# EAGLE board Xibeca00 (EAGLE 9.6.2)
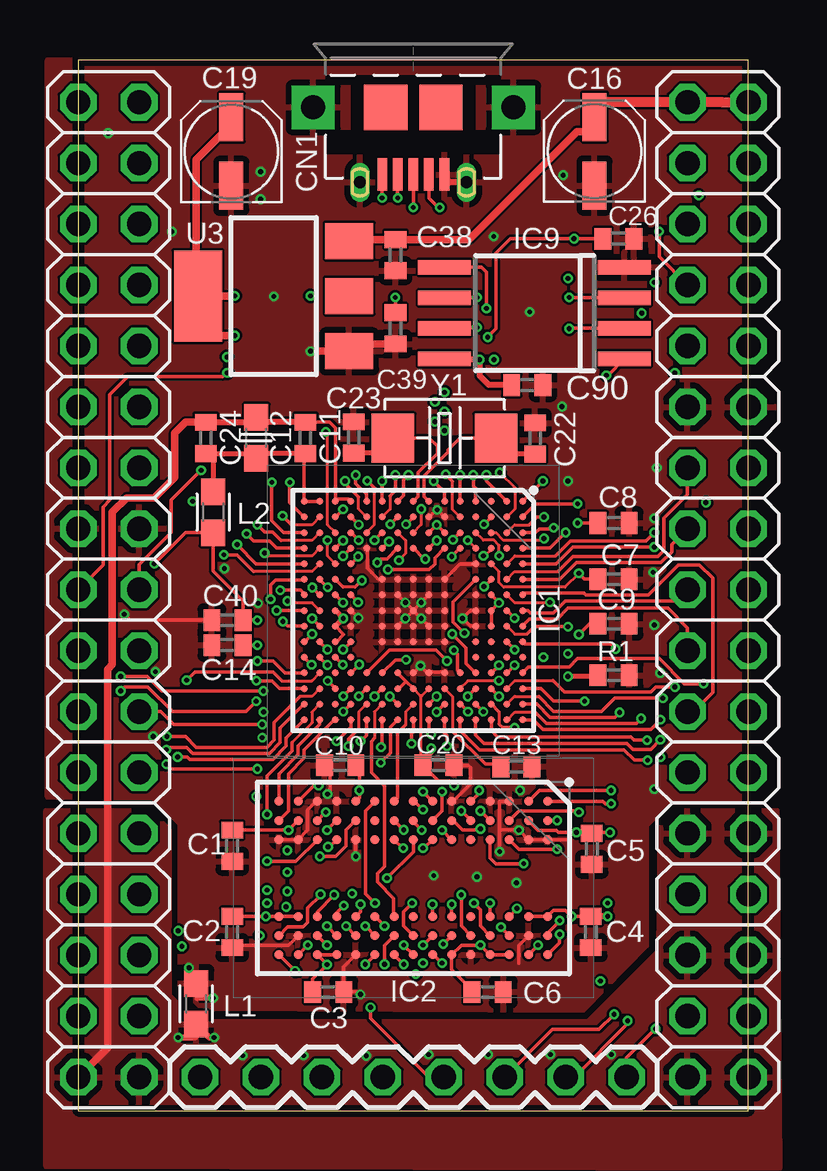
[diagram p2: board, top side]
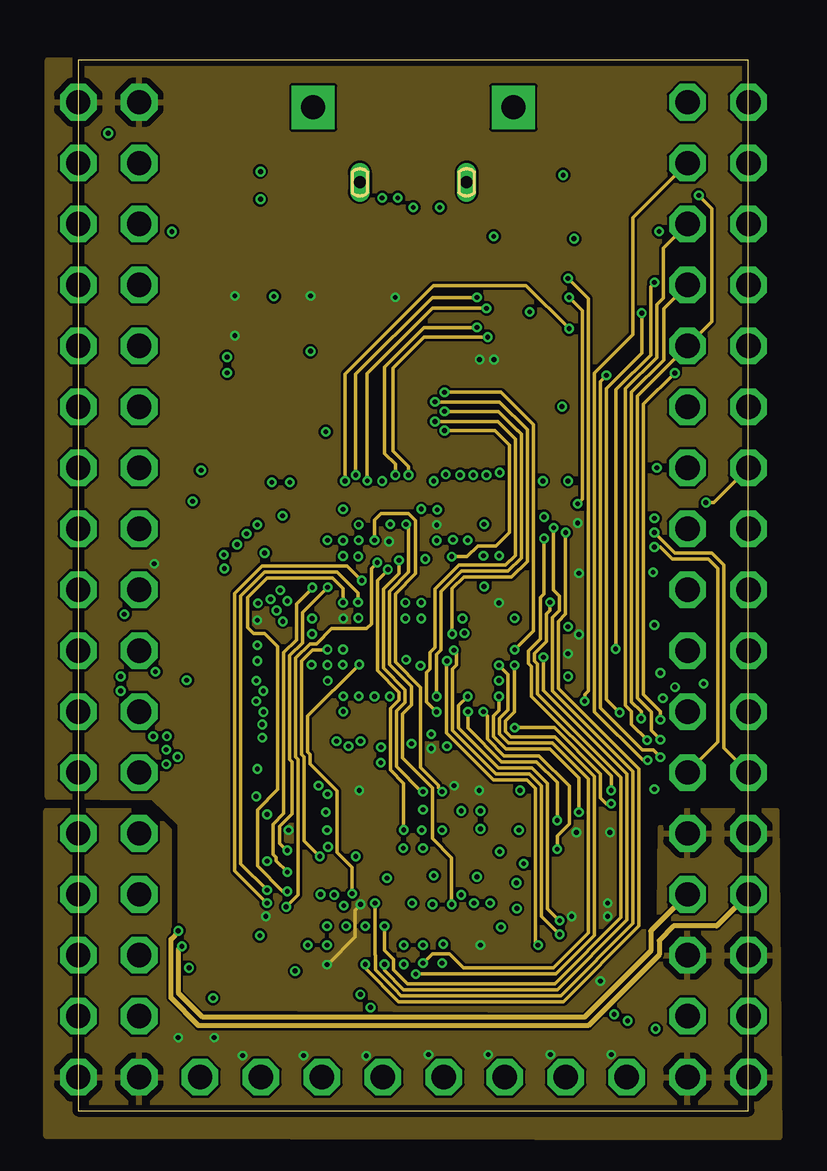
[diagram p3: board, inner layer InnerTop]
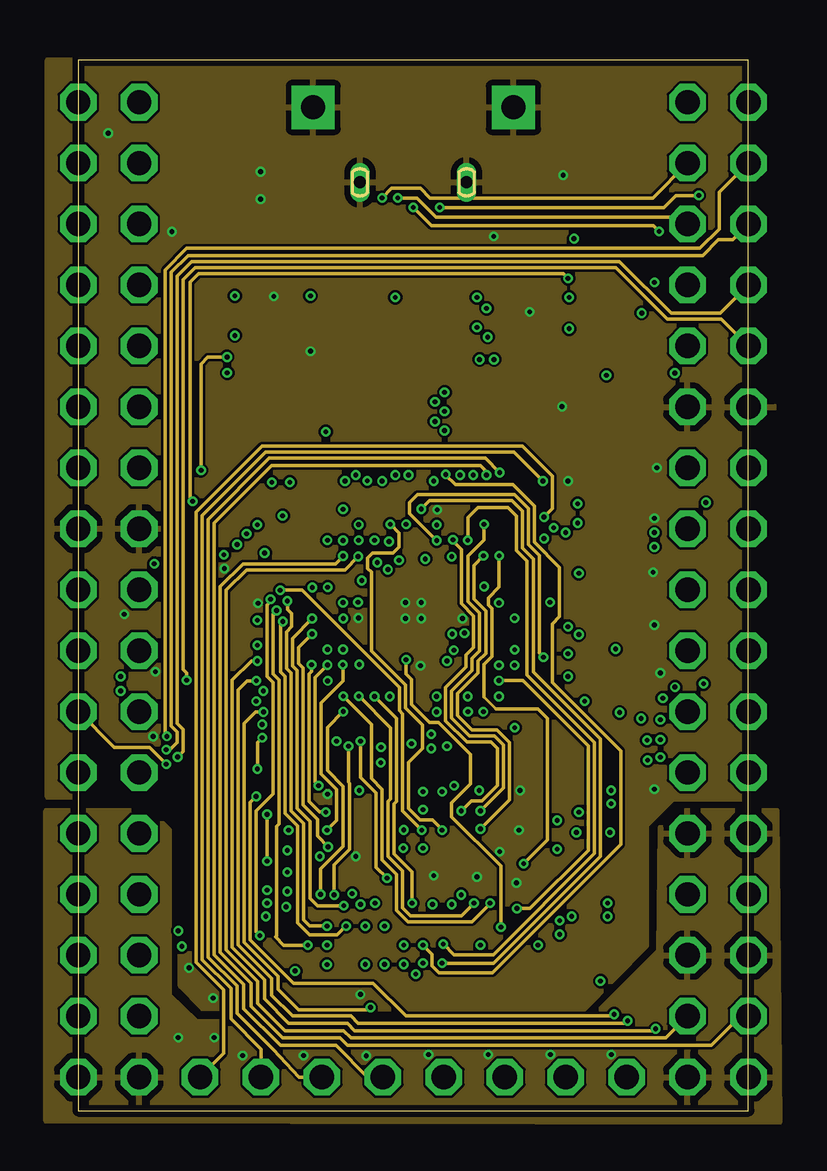
[diagram p4: board, inner layer InnerBottom]
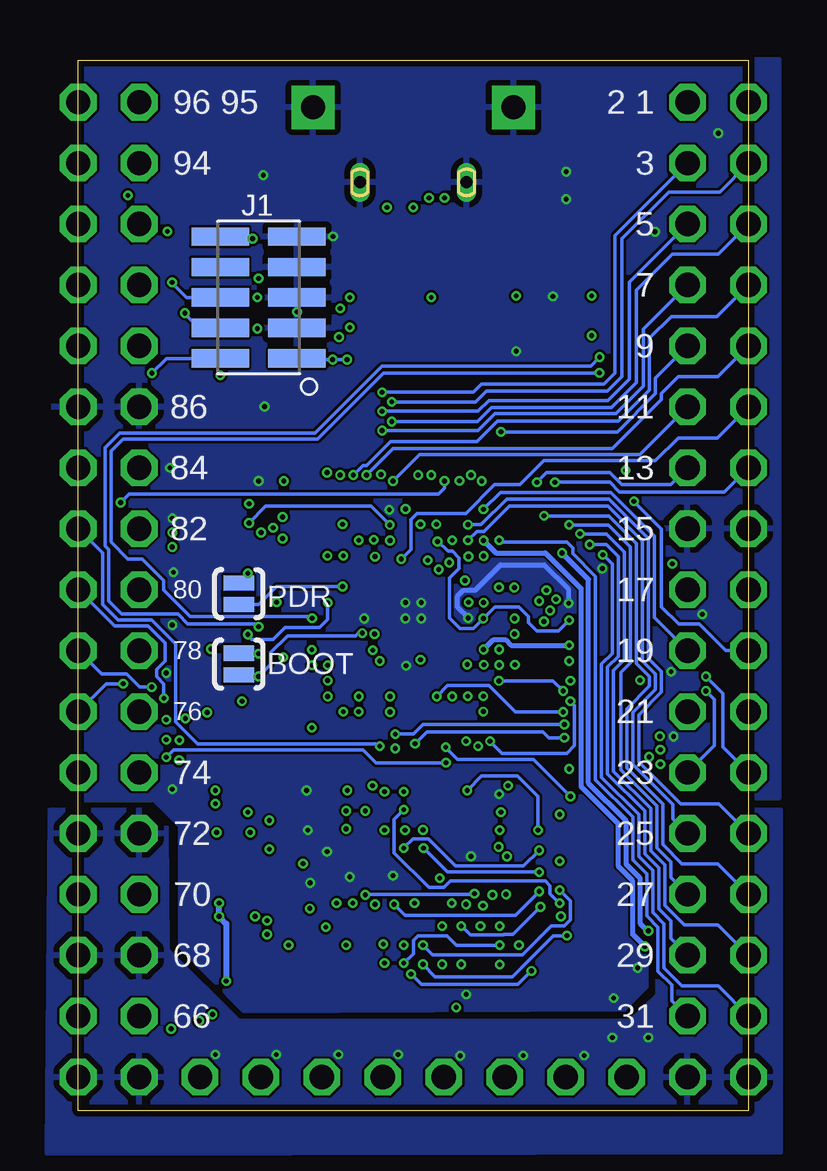
[diagram p5: board, bottom side, seen from below]

Size 27.94 x 43.8 mm. Coordinates in mm from the lower left corner, seen from the top.
Outline: 0,0 27.94,0 27.94,43.8 0,43.8 0,0
Copper layers (1*2*15*16): Top 0.035mm / dielectric 0.2mm / InnerTop 0.0175mm / dielectric 0.3mm / InnerBottom 0.0175mm / dielectric 0.2mm / Bottom 0.035mm
Design rules "PCBWay_4layer_20210129 *": minimum track width 0.1mm, minimum drill 0.2mm, track to track 0.1mm, track to pad 0.1mm, pad to pad 0.1mm, via to via 0.1mm, smd to smd 0mil, copper to edge 10mil, drill to drill 0.25mm, minimum pad ring 6mil, minimum via ring 4mil, stop-mask expansion 2mil, vias tented up to drill 25mil, thermal gap 10mil
Net classes: 1 power: width 0.178 mm, drill 0.305 mm, clearance 0.178 mm to class 0, clearance 0.178 mm

## Footprints (pad centres in the part's own frame; a part is rotated, then mirrored left to right if it is on the bottom)
SJ_2S-NO = smd 0.635 x 1.27: 1 -0.45,0; 2 0.45,0
C0402 = smd 0.7 x 0.9: 1 -0.65,0; 2 0.65,0
C0603 = smd 1.1 x 1: 1 -0.85,0; 2 0.85,0
UD-4X5,8_NICHICON = smd 2 x 1: + 1.425,0; - -1.425,0
HRS_ZX62RD-AB-5P8 = smd 0.4 x 1.35: 1 1.3,2.275; 2 0.65,2.275; 3 0,2.275; 4 -0.65,2.275; 5 -1.3,2.275 | smd 1.8 x 1.9: D_0 -1.15,-0.525; D_1 1.15,-0.525 | drill 1 pad 1.8 square: G -4.175,-0.525; G2 4.175,-0.525 | drill 0.5 long: G3 -2.225,2.6; G4 2.225,2.6
BGA201C65P15X15_1000X1000X60 = smd 0.3 x 0.3: A1 -4.55,4.55; A2 -3.9,4.55; A3 -3.25,4.55; A4 -2.6,4.55; A5 -1.95,4.55; A6 -1.3,4.55; A7 -0.65,4.55; A8 0,4.55; A9 0.65,4.55; A10 1.3,4.55; A11 1.95,4.55; A12 2.6,4.55; A13 3.25,4.55; A14 3.9,4.55; A15 4.55,4.55; B1 -4.55,3.9; B2 -3.9,3.9; B3 -3.25,3.9; B4 -2.6,3.9; B5 -1.95,3.9; B6 -1.3,3.9; B7 -0.65,3.9; B8 0,3.9; B9 0.65,3.9; B10 1.3,3.9; B11 1.95,3.9; B12 2.6,3.9; B13 3.25,3.9; B14 3.9,3.9; B15 4.55,3.9; C1 -4.55,3.25; C2 -3.9,3.25; C3 -3.25,3.25; C4 -2.6,3.25; C5 -1.95,3.25; C6 -1.3,3.25; C7 -0.65,3.25; C8 0,3.25; C9 0.65,3.25; C10 1.3,3.25; C11 1.95,3.25; C12 2.6,3.25; C13 3.25,3.25; C14 3.9,3.25; C15 4.55,3.25; D1 -4.55,2.6; D2 -3.9,2.6; D3 -3.25,2.6; D4 -2.6,2.6; D5 -1.95,2.6; D6 -1.3,2.6; D7 -0.65,2.6; D8 0,2.6; D9 0.65,2.6; D10 1.3,2.6; D11 1.95,2.6; D12 2.6,2.6; D13 3.25,2.6; D14 3.9,2.6; D15 4.55,2.6; E1 -4.55,1.95; E2 -3.9,1.95; E3 -3.25,1.95; E4 -2.6,1.95; E12 2.6,1.95; E13 3.25,1.95; E14 3.9,1.95; E15 4.55,1.95; F1 -4.55,1.3; F2 -3.9,1.3; F3 -3.25,1.3; F4 -2.6,1.3; F6 -1.3,1.3; F7 -0.65,1.3; F8 0,1.3; F9 0.65,1.3; F10 1.3,1.3; F12 2.6,1.3; F13 3.25,1.3; F14 3.9,1.3; F15 4.55,1.3; G1 -4.55,0.65; G2 -3.9,0.65; G3 -3.25,0.65; G4 -2.6,0.65; G6 -1.3,0.65; G7 -0.65,0.65; G8 0,0.65; G9 0.65,0.65; G10 1.3,0.65; G12 2.6,0.65; G13 3.25,0.65; G14 3.9,0.65; G15 4.55,0.65; H1 -4.55,0; H2 -3.9,0; H3 -3.25,0; H4 -2.6,0; H6 -1.3,0; H7 -0.65,0; H8 0,0; H9 0.65,0; H10 1.3,0; H12 2.6,0; H13 3.25,0; H14 3.9,0; H15 4.55,0; J1 -4.55,-0.65; J2 -3.9,-0.65; J3 -3.25,-0.65; J4 -2.6,-0.65; J6 -1.3,-0.65; J7 -0.65,-0.65; J8 0,-0.65; J9 0.65,-0.65; J10 1.3,-0.65; J12 2.6,-0.65; J13 3.25,-0.65; J14 3.9,-0.65; J15 4.55,-0.65; K1 -4.55,-1.3; K2 -3.9,-1.3; K3 -3.25,-1.3; K4 -2.6,-1.3; K6 -1.3,-1.3; K7 -0.65,-1.3; K8 0,-1.3; K9 0.65,-1.3; K10 1.3,-1.3; K12 2.6,-1.3; K13 3.25,-1.3; K14 3.9,-1.3; K15 4.55,-1.3; L1 -4.55,-1.95; L2 -3.9,-1.95; L3 -3.25,-1.95; L4 -2.6,-1.95; L12 2.6,-1.95; L13 3.25,-1.95; L14 3.9,-1.95; L15 4.55,-1.95; M1 -4.55,-2.6; M2 -3.9,-2.6; M3 -3.25,-2.6; M4 -2.6,-2.6; M5 -1.95,-2.6; M6 -1.3,-2.6; M7 -0.65,-2.6; M8 0,-2.6; M9 0.65,-2.6; M10 1.3,-2.6; M11 1.95,-2.6; M12 2.6,-2.6; M13 3.25,-2.6; M14 3.9,-2.6; M15 4.55,-2.6; N1 -4.55,-3.25; N2 -3.9,-3.25; N3 -3.25,-3.25; N4 -2.6,-3.25; N5 -1.95,-3.25; N6 -1.3,-3.25; N7 -0.65,-3.25; N8 0,-3.25; N9 0.65,-3.25; N10 1.3,-3.25; N11 1.95,-3.25; N12 2.6,-3.25; N13 3.25,-3.25; N14 3.9,-3.25; N15 4.55,-3.25; P1 -4.55,-3.9; P2 -3.9,-3.9; P3 -3.25,-3.9; P4 -2.6,-3.9; P5 -1.95,-3.9; P6 -1.3,-3.9; P7 -0.65,-3.9; P8 0,-3.9; P9 0.65,-3.9; P10 1.3,-3.9; P11 1.95,-3.9; P12 2.6,-3.9; P13 3.25,-3.9; P14 3.9,-3.9; P15 4.55,-3.9; R1 -4.55,-4.55; R2 -3.9,-4.55; R3 -3.25,-4.55; R4 -2.6,-4.55; R5 -1.95,-4.55; R6 -1.3,-4.55; R7 -0.65,-4.55; R8 0,-4.55; R9 0.65,-4.55; R10 1.3,-4.55; R11 1.95,-4.55; R12 2.6,-4.55; R13 3.25,-4.55; R14 3.9,-4.55; R15 4.55,-4.55
BGA90C80P9X15_800X1300X100 = smd 0.37 x 0.37: A1 -3.2,5.6; A2 -2.4,5.6; A3 -1.6,5.6; A7 1.6,5.6; A8 2.4,5.6; A9 3.2,5.6; B1 -3.2,4.8; B2 -2.4,4.8; B3 -1.6,4.8; B7 1.6,4.8; B8 2.4,4.8; B9 3.2,4.8; C1 -3.2,4; C2 -2.4,4; C3 -1.6,4; C7 1.6,4; C8 2.4,4; C9 3.2,4; D1 -3.2,3.2; D2 -2.4,3.2; D3 -1.6,3.2; D7 1.6,3.2; D8 2.4,3.2; D9 3.2,3.2; E1 -3.2,2.4; E2 -2.4,2.4; E3 -1.6,2.4; E7 1.6,2.4; E8 2.4,2.4; E9 3.2,2.4; F1 -3.2,1.6; F2 -2.4,1.6; F3 -1.6,1.6; F7 1.6,1.6; F8 2.4,1.6; F9 3.2,1.6; G1 -3.2,0.8; G2 -2.4,0.8; G3 -1.6,0.8; G7 1.6,0.8; G8 2.4,0.8; G9 3.2,0.8; H1 -3.2,0; H2 -2.4,0; H3 -1.6,0; H7 1.6,0; H8 2.4,0; H9 3.2,0; J1 -3.2,-0.8; J2 -2.4,-0.8; J3 -1.6,-0.8; J7 1.6,-0.8; J8 2.4,-0.8; J9 3.2,-0.8; K1 -3.2,-1.6; K2 -2.4,-1.6; K3 -1.6,-1.6; K7 1.6,-1.6; K8 2.4,-1.6; K9 3.2,-1.6; L1 -3.2,-2.4; L2 -2.4,-2.4; L3 -1.6,-2.4; L7 1.6,-2.4; L8 2.4,-2.4; L9 3.2,-2.4; M1 -3.2,-3.2; M2 -2.4,-3.2; M3 -1.6,-3.2; M7 1.6,-3.2; M8 2.4,-3.2; M9 3.2,-3.2; N1 -3.2,-4; N2 -2.4,-4; N3 -1.6,-4; N7 1.6,-4; N8 2.4,-4; N9 3.2,-4; P1 -3.2,-4.8; P2 -2.4,-4.8; P3 -1.6,-4.8; P7 1.6,-4.8; P8 2.4,-4.8; P9 3.2,-4.8; R1 -3.2,-5.6; R2 -2.4,-5.6; R3 -1.6,-5.6; R7 1.6,-5.6; R8 2.4,-5.6; R9 3.2,-5.6
SO8W = smd 0.6 x 2.2: 1 -1.905,-3.75; 2 -0.635,-3.75; 3 0.635,-3.75; 4 1.905,-3.75; 5 1.905,3.75; 6 0.635,3.75; 7 -0.635,3.75; 8 -1.905,3.75
2X5_1.27MM_SMD = smd 2.4 x 0.76: 1 -1.6,2.54; 2 1.6,2.54; 3 -1.6,1.27; 4 1.6,1.27; 5 -1.6,0; 6 1.6,0; 7 -1.6,-1.27; 8 1.6,-1.27; 9 -1.6,-2.54; 10 1.6,-2.54
1X08 = drill 1.016 octagon: 1 0,0; 2 2.54,0; 3 5.08,0; 4 7.62,0; 5 10.16,0; 6 12.7,0; 7 15.24,0; 8 17.78,0
2X17 = drill 1.016 octagon: 1 -20.32,-1.27; 2 -20.32,1.27; 3 -17.78,-1.27; 4 -17.78,1.27; 5 -15.24,-1.27; 6 -15.24,1.27; 7 -12.7,-1.27; 8 -12.7,1.27; 9 -10.16,-1.27; 10 -10.16,1.27; 11 -7.62,-1.27; 12 -7.62,1.27; 13 -5.08,-1.27; 14 -5.08,1.27; 15 -2.54,-1.27; 16 -2.54,1.27; 17 0,-1.27; 18 0,1.27; 19 2.54,-1.27; 20 2.54,1.27; 21 5.08,-1.27; 22 5.08,1.27; 23 7.62,-1.27; 24 7.62,1.27; 25 10.16,-1.27; 26 10.16,1.27; 27 12.7,-1.27; 28 12.7,1.27; 29 15.24,-1.27; 30 15.24,1.27; 31 17.78,-1.27; 32 17.78,1.27; 33 20.32,-1.27; 34 20.32,1.27
0603 = smd 1.1 x 1: 1 -0.85,0; 2 0.85,0
R0402 = smd 0.7 x 0.9: 1 -0.65,0; 2 0.65,0
SOT223 = smd 1.5 x 2: 1 -2.3,-3.15; 2 0,-3.15; 3 2.3,-3.15 | smd 3.8 x 2: 4 0,3.15
X2-SMD-5.0X3.2X1.3MM = smd 1.778 x 2.032: 1 -2.159,0; 2 2.159,0

## Placement (x,y rotation side)
BOOT  SOLDERJUMPERNO  [SJ_2S-NO]  21.24,18.62 270 bottom
BOOT1  SOLDERJUMPERNO  [SJ_2S-NO]  21.24,21.55 270 bottom
C1  100n  [C0402]  6.42,11.05 270 top
C2  100n  [C0402]  6.42,7.45 270 top
C3  100n  [C0402]  10.42,4.95 0 top
C4  100n  [C0402]  21.37,7.45 270 top
C5  100n  [C0402]  21.41,10.91 270 top
C6  100n  [C0402]  17.07,4.95 0 top
C7  100n  [C0402]  22.32,22.15 0 top
C8  100n  [C0402]  22.32,24.5 0 top
C9  100n  [C0402]  22.32,20.3 0 top
C10  100n  [C0402]  10.92,14.4 180 top
C11  100n  [C0402]  9.47,28.05 90 top
C12  1u  [C0603]  7.42,28.05 90 top
C13  2u2  [C0402]  18.27,14.35 0 top
C14  2u2  [C0402]  6.22,19.41 180 top
C16  10u  [UD-4X5,8_NICHICON]  21.52,39.99 90 top
C19  10u  [UD-4X5,8_NICHICON]  6.38,39.98 90 top
C20  100n  [C0402]  15.02,14.4 0 top
C22  22p  [C0402]  19.05,28.02 90 top
C23  22p  [C0402]  11.49,28.06 90 top
C24  100n  [C0402]  5.32,28.05 90 top
C26  100n  [C0402]  22.52,36.35 0 top
C38  100n  [C0402]  13.23,35.66 90 top
C39  100n  [C0402]  13.23,32.61 270 top
C40  100n  [C0402]  6.22,20.45 180 top
C90  100n  [C0402]  18.72,30.25 0 top
CN1  [HRS_ZX62RD-AB-5P8]  13.97,41.3 180 top
IC1  STM32H743IIK6  [BGA201C65P15X15_1000X1000X60]  13.97,20.85 270 top
IC2  AS4C16M32MSA-6BIN  [BGA90C80P9X15_800X1300X100]  13.97,9.7 270 top
IC9  S25FL064LABMFI010  [SO8W]  19.02,33.25 90 top
J1  FTS-105-01-F-DV  [2X5_1.27MM_SMD]  20.42,33.9 180 bottom
JP3  [1X08]  5.08,1.4 0 top
JP4  [2X17]  1.27,21.72 270 top
JP5  [2X17]  26.67,21.72 270 top
L1  Ferrite Bead  [0603]  4.92,4.45 90 top
L2  Ferrite Bead  [0603]  5.62,24.95 270 top
R1  10k  [R0402]  22.32,18.15 180 top
U3  TLV1117LV33DCYR  [SOT223]  8.14,33.96 90 top
Y1  8MHz  [X2-SMD-5.0X3.2X1.3MM]  15.27,28.04 0 top

## Tracks (layer width: path | path; a pad name or v marks a point on that pad's centre or on a via)
+3V3  (via drill 0.2)
  Top 0.13: IC1.G13 14.32,17.3 | 14.27,17.3 IC1.H13 | 14.29,14.48 14.29,17.3 | v20.87,22.4 20.3,21.83 17.73,21.83 17.55,22.01 17.55,22.47 IC1.C5
  Top 0.15: v11.77,8.6 11.77,8.3 IC2.L7 | IC2.M9 IC2.N9 v10.37,6.1 v10.37,6.09 9.77,5.49 C3.1 | IC2.B7 IC2.A7 19.82,8.35 20.32,8.35 v20.57,8.1 C4.1 | IC2.P7 IC2.R7 v7.82,8.1 C2.1 | IC2.P2 v8.77,11.7 C1.1 | IC2.L1 11.72,13.05 v11.72,13.35 11.72,14.25 C10.1 | v16.72,13.35 16.72,13.25 IC2.E1 | IC2.C9 IC2.D9 v16.77,6.9 15.97,6.9 IC2.F9 15.57,5.9 16.42,5.05 C6.1 | 14.32,17.3 14.29,17.3 14.27,17.3 | v12.96,23.73 IC1.K4 | IC1.N9 11.07,19.85 10.77,19.55 IC1.N10 | IC1.G3 v14.95,24.42 IC1.F3 | C39.1 v13.23,33.89 v13.22,33.9 | IC1.J12 13.67,17.9 | IC1.J13 13.37,17.6 13.67,17.9 | IC1.H13 13.67,17.9 | v7.47,20.45 C40.1 6.87,21.25 5.62,22.5 L2.2 4.47,24.1 v3.17,22.8 | C20.1 14.29,14.48 | C9.1 21.32,20.3 v20.87,19.85 | C8.1 v20.82,24.5 | v20.87,22.4 21.1,22.17 21.65,22.17 | v22.17,11.6 21.45,11.6 C5.1 21.38,11.6 v20.77,11.6 20.02,11.6 19.93,11.69 19.17,11.69 IC2.B2 | v14.72,15.1 14.72,14.9 14.37,14.55 C20.1 | C20.1 15.02,13.75 15.47,13.75 v15.67,13.55 | IC1.C9 IC1.C8 v17.54,21.17 IC1.C7
  Top 0.152: C7.1 21.65,22.17
  Top 0.2: IC1.N9 v11.05,20.52 IC1.N8
  Top 0.254: IC9.8 15.3,31.31 v16.73,31.31 16.73,30.64 17.12,30.25 C90.1 | v22.07,8.1 C4.1
  Top 0.305: C19.+ 6.38,41.1 4.92,39.65 4.92,34.03 U3.4 | v6.53,32.31 5.53,32.31 | v6.53,33.96 5.03,33.96 4.99,34
  Top 0.406: 4.99,34 U3.4 4.99,32.84 5.53,32.31
  InnerTop 0.15: v11.77,8.6 11.77,8.58 11.55,8.36 11.55,7.24 10.43,6.12 10.4,6.12 v10.37,6.09
  Bottom 0.15: J1.1 18.77,31.31 v16.73,31.31 | v7.47,20.45 7.92,20 8.82,20 9.17,20.35 9.17,20.6 9.57,21 10.57,21 v11.05,20.52 11.47,20.1 12.02,20.1 12.47,20.55 12.47,22.2 12.07,22.6 12.07,23.05 12.34,23.32 12.53,23.32 12.93,23.73 v12.96,23.73 | v20.42,19.05 20.44,19.07 BOOT.1 | v14.95,24.42 15.73,25.2 20.12,25.2 v20.82,24.5 | BOOT1.1 21.24,22.02 v20.87,22.4 | v11.72,13.35 11.12,13.95 9.62,13.95 8.77,13.1 v8.77,11.7 | v20.87,19.85 20.87,19.8 20.72,19.65 19.82,19.65 19.32,20.15 17.87,20.15 17.54,20.48 v17.54,21.17
  Bottom 0.254: v21.77,5.4 21.77,7.8 v22.07,8.1 v22.07,8.65
  other vias: 9.68,33.96 17.33,31.31
  pour InnerTop: -1.27,43.8 28.97,43.8 28.97,13 24.77,13 23.67,11.9 23.67,6.87 21.03,4.19 5.19,4.26 4.27,5.19 4.27,11.96 3.15,13.03 -1.27,13.07
+5V
  Top 0.305: 21.58,42.04 21.57,42.05 21.52,42 C16.+ 21.52,41.17 21.17,40.82 20.79,40.82 16.29,36.31 C38.2 11.35,36.31 11.23,36.19
  Top 0.406: U3.3 11.23,36.19 | JP5.2 26.82,42.04 JP5.1 21.58,42.04
+A3V3
  Top 0.15: C11.1 9.42,27.35 IC1.R1 IC1.P1
  Top 0.2: C24.1 5.62,27.1 L2.1
  Top 0.203: C11.1 7.62,27.4 C12.1 7.22,27.4 C24.1
ADC_I2C_SCL  (via drill 0.2)
  Top 0.15: IC1.R12 8.62,18.25 8.12,18.75 v7.47,18.75 | JP3.8 22.86,2.2 v24.07,3.41
  InnerBottom 0.15: v7.47,18.75 7.22,18.75 6.42,17.95 6.42,6.8 7.76,5.46 7.76,4.66 8.78,3.64 11.22,3.64 11.52,3.34 24,3.34 v24.07,3.41
ADC_I2C_SDA  (via drill 0.2)
  Top 0.15: IC1.R13 8.39,17.6 8.07,17.92 v7.42,17.92 | JP3.7 20.68,1.4 22.9,3.62 v22.9,3.74
  InnerBottom 0.15: v7.42,17.92 7.04,17.92 6.67,17.55 6.67,6.91 8.07,5.51 8.07,4.81 8.93,3.95 11.37,3.95 11.68,3.64 22.8,3.64 v22.9,3.74
ADC_IN3  (via drill 0.2)
  Top 0.13: IC1.P3 9.74,23.77 8.45,23.77
  Top 0.15: 8.45,23.77 8.1,24.12 7.77,24.12 v7.47,24.42
  Bottom 0.15: JP4.28 3.24,9.72 3.24,10.37 3.82,10.95 3.82,12.69 5.32,14.19 5.32,18.27 4.92,18.67 4.92,23.5 5.84,24.42 v7.47,24.42
ADC_IN4  (via drill 0.2)
  Top 0.13: IC1.N5 10.39,23.13 v10.39,23.78
  Bottom 0.15: JP4.32 3.19,4.59 3.19,5.24 3.77,5.82 3.77,7.65 4.24,8.12 4.24,9.87 4.82,10.45 4.82,12.24 6.37,13.79 6.37,22.26 7.32,23.21 7.32,23.45 7.57,23.7 10.31,23.7 v10.39,23.78
ADC_IN5  (via drill 0.2)
  Top 0.15: IC1.R4 8.27,23.45 7.97,23.74 7.32,23.74 v7.02,24.04
  Bottom 0.15: JP4.29 1.27,7.75 2.67,7.75 3.49,8.57 3.49,10.25 4.07,10.83 4.07,12.59 5.62,14.14 5.62,18.36 5.17,18.81 5.17,23.3 5.92,24.04 v7.02,24.04
ADC_IN8  (via drill 0.2)
  Top 0.13: IC1.P5 9.75,22.48 7.31,22.48
  Top 0.15: 7.31,22.48 6.62,23.17 v6.07,23.17
  Bottom 0.15: JP4.31 1.26,5.2 2.77,5.2 3.52,5.95 3.52,7.79 3.99,8.26 3.99,10.01 4.57,10.59 4.57,12.35 6.12,13.9 6.12,18.61 5.67,19.06 5.67,22.8 6.04,23.17 v6.07,23.17
ADC_IN9  (via drill 0.2)
  Top 0.15: IC1.R5 7.42,22.8 v6.62,23.6
  Bottom 0.15: JP4.30 3.24,7.18 3.24,7.92 3.74,8.42 3.74,10.11 4.32,10.69 4.32,12.49 5.87,14.04 5.87,18.49 5.42,18.94 5.42,23.09 5.92,23.6 v6.62,23.6
ADC_IN10  (via drill 0.2)
  Top 0.15: IC1.M2 v11.69,24.43
  Bottom 0.15: JP4.25 1.24,12.8 2.82,12.8 4.57,14.55 4.57,16.5 3.62,17.45 3.62,18.3 4.17,18.85 4.17,23.85 5.81,25.5 10.07,25.5 11.14,24.43 v11.69,24.43
ADC_IN11  (via drill 0.2)
  Top 0.15: IC1.M3 v11.69,23.78
  Bottom 0.15: JP4.26 3.14,12.16 3.14,12.76 4.82,14.44 4.82,16.6 3.87,17.55 3.87,18.2 4.42,18.75 4.42,23.75 5.87,25.2 9.97,25.2 11.02,24.15 11.32,24.15 v11.69,23.78
ADC_IN14  (via drill 0.2)
  Top 0.13: IC1.P2 9.74,24.42 8.9,24.42
  Top 0.15: 8.9,24.42 v8.52,24.8
  Bottom 0.15: JP4.27 1.28,10.3 2.78,10.3 3.57,11.09 3.57,12.8 5.07,14.3 5.07,16.75 4.12,17.7 4.12,18.09 4.67,18.64 4.67,23.65 5.82,24.8 v8.52,24.8
ADC_RST  (via drill 0.2)
  Top 0.15: IC1.K15 12.67,15.2 v12.62,15.15 | JP3.6 19.77,3.39 21.71,3.39 v22.34,4.02
  InnerBottom 0.15: v7.42,13.1 7.17,12.85 7.17,7.12 8.97,5.32 12.28,5.32 13.66,3.95 22.27,3.95 v22.34,4.02
  Bottom 0.15: v12.62,15.15 12.12,14.65 8.97,14.65 v7.42,13.1
ADC_SPI_MISO  (via drill 0.2)
  Top 0.15: IC1.M4 v11.04,23.12
  InnerBottom 0.15: v11.04,23.12 v11.04,23.11 10.73,22.8 6.87,22.8 5.92,21.85 5.92,6.6 7.2,5.31 7.2,4.35 8.53,3.03 10.91,3.03 11.22,2.73 26.4,2.73 27.61,3.94 JP5.32
ADC_SPI_MOSI  (via drill 0.2)
  Top 0.15: IC1.M5 v11.67,23.1
  InnerBottom 0.15: v11.67,23.1 11.12,22.55 7.02,22.55 6.17,21.7 6.17,6.7 7.48,5.39 7.48,4.48 8.63,3.34 11.06,3.34 11.37,3.03 17.72,3.03 18.08,3.03 24.49,3.03 JP5.31
AGND  (via drill 0.2)
  Top 0.15: IC1.M1 11.27,25.5 10.82,25.5 IC1.N1 10.72,28.45 10.47,28.7 C11.2 | 7.57,28.7 C12.2
  Top 0.254: v4.17,3.05 4.87,3.05 4.87,3.55 L1.1 5.48,3.05 v5.67,3.05 | C11.2 7.57,28.7 | C24.2 7.22,28.7 C12.2
  Top 0.305: C24.2 4.47,28.7 4.02,28.25 4.02,26.4 3.17,25.55 2.02,25.55 1.42,24.95 1.42,18.6 1.22,18.4 1.22,2.62 JP4.33
  other vias: 12.01,2.29 9.39,2.3 6.85,2.3 14.6,2.34 17.09,2.34 19.68,2.34 22.22,2.34
  pour InnerBottom: -1.33,12.5 2.97,12.5 3.77,11.7 3.77,4.81 4.92,3.7 21.26,3.7 24.23,6.66 24.28,11.79 24.98,12.5 29.11,12.5 29.22,-0.49 -1.33,-0.42
  pour Top: -1.33,12.5 2.97,12.5 3.77,11.7 3.77,4.8 4.91,3.7 21.26,3.7 24.23,6.66 24.28,11.79 24.98,12.5 29.11,12.5 29.24,-2.39 -1.33,-2.33
  pour InnerTop: -1.33,12.5 2.97,12.5 3.77,11.7 3.77,4.81 4.92,3.7 21.26,3.7 24.23,6.66 24.28,11.79 24.98,12.5 29.11,12.5 29.23,-1.12 -1.33,-1.06
  pour Bottom: -1.33,12.5 2.97,12.5 3.77,11.7 3.77,4.81 4.92,3.7 21.26,3.7 24.23,6.66 24.28,11.79 24.98,12.5 29.11,12.5 29.23,-1.76 -1.33,-1.69
BOOT  (via drill 0.2)
  Top 0.15: IC1.D6 15.62,21.2 15.62,20.38 v16.09,19.91 v16.1,19.91
  Top 0.2: R1.2 21.42,18.1 v20.42,18.1
  Bottom 0.15: v16.1,19.91 16.26,19.91 16.37,19.8 19.22,19.8 19.92,19.1 19.92,18.6 v20.42,18.1 21.18,18.1 BOOT.2
DAC1  (via drill 0.2)
  Top 0.15: IC1.N4 11.07,23.8 11.07,23.79 v11.04,23.77
  InnerTop 0.2: JP5.27 23.87,7.49 23.87,6.65 21.11,3.9 17.72,3.9 5.19,3.9 4.17,4.92 4.17,6.7 v4.32,6.85
  Bottom 0.2: v4.32,6.85 4.82,7.35 4.82,9.57 5.42,10.17 5.42,11.95 6.97,13.5 6.97,21.75 8.47,23.25 10.53,23.25 v11.04,23.77
DAC2  (via drill 0.2)
  Top 0.13: IC1.P4 9.75,23.13 7.89,23.13
  Top 0.15: 7.89,23.13 v7.77,23.25
  InnerTop 0.2: JP5.28 26.62,7.7 24.82,7.7 24.22,7.1 24.22,6.5 21.26,3.55 5.02,3.55 3.87,4.7 3.87,7.15 4.17,7.45 v4.17,7.5
  Bottom 0.2: v4.17,7.5 4.2,7.5 4.52,7.81 4.52,9.7 5.09,10.27 5.09,12.07 6.67,13.65 6.67,22.15 v7.77,23.25
EXTI0  (via drill 0.2)
  Top 0.13: IC1.N3 10.4,24.42 10.4,28.22
  Top 0.15: 10.4,28.22 v10.32,28.3
  Bottom 0.15: JP4.10 3.87,30.55 3.87,29.88 5.47,28.3 v10.32,28.3
EXTI2  (via drill 0.2)
  Top 0.15: IC1.D12 16.17,18.65 16.17,19.29 v15.59,19.87
  InnerTop 0.15: v15.59,19.87 15.59,21.76 16.07,22.25 18.07,22.25 18.72,22.9 18.72,28.4 17.57,29.55 v14.87,29.55
  Bottom 0.15: v14.87,29.55 11.37,29.55 10.92,30 5.87,30 5.27,30.6 5.27,36.35 3.32,38.3 1.2,38.3 JP4.3
EXTI3  (via drill 0.2)
  Top 0.15: IC1.R2 8.82,25.35 v8.82,26.2
  Bottom 0.15: JP4.14 3.24,26.1 5.27,26.1 5.77,26.6 8.42,26.6 v8.82,26.2
EXTI4  (via drill 0.2)
  Top 0.15: IC1.H4 14.42,23 v14.47,23
  Bottom 0.15: JP4.11 1.29,28.05 2.93,28.05 3.88,27.1 8.52,27.1 9.52,26.1 10.58,26.1 11.78,24.9 13.81,24.9 14.07,24.64 14.07,23.4 v14.47,23
EXTI7  (via drill 0.2)
  Top 0.15: IC1.R3 8.57,24.1 8.07,24.6 v8.07,26.2
  Bottom 0.15: v8.07,26.2 5.77,26.2 5.37,25.8 1,25.8 JP4.13
EXTI8  (via drill 0.2)
  Top 0.15: IC1.G14 v14.94,17.27
  InnerTop 0.15: v14.94,17.27 14.94,19.02 15.12,19.2 15.12,21.65 15.97,22.5 17.92,22.5 18.47,23.04 18.47,28.2 18.32,28.35 17.52,29.15 v15.28,29.15 v15.27,29.15
  Bottom 0.15: v15.27,29.15 11.27,29.15 10.82,29.6 5.87,29.6 4.97,30.5 4.97,34.53 JP4.6
EXTI9  (via drill 0.2)
  Top 0.15: IC1.F14 v14.94,16.62
  InnerTop 0.15: v14.94,16.62 14.52,17.04 14.52,18.26 14.67,18.41 14.67,19.1 14.87,19.3 14.87,21.75 15.87,22.75 17.82,22.75 18.22,23.15 18.22,28 17.49,28.72 v14.87,28.72
  Bottom 0.15: JP4.5 1.26,35.7 3.17,35.7 4.67,34.2 4.67,30.35 5.72,29.3 10.72,29.3 11.29,28.72 v14.87,28.72
EXTI10  (via drill 0.2)
  Top 0.15: IC1.B10 v18.2,19.22
  InnerTop 0.15: v18.2,19.22 18.97,19.99 18.97,28.6 17.62,29.95 v15.27,29.95
  Bottom 0.15: v15.27,29.95 11.47,29.95 11.12,30.3 6.02,30.3 5.57,30.75 5.57,36.47 JP4.4
EXTI11  (via drill 0.2)
  Top 0.15: IC1.E4 v15.57,23.09
  InnerTop 0.15: v15.57,23.09 16.22,23.09 16.67,23.55 17.42,23.55 17.97,24.1 17.97,27.75 17.37,28.35 v15.27,28.35
  Bottom 0.15: JP4.8 4.37,32.59 4.37,30.2 5.52,29.05 10.57,29.05 11.27,28.35 v15.27,28.35
EXTI13  (via drill 0.2)
  Top 0.15: v16.47,26.5 16.47,26.05 16.57,25.95 IC1.D1
  Bottom 0.15: JP4.7 1.32,33.1 3.22,33.1 4.12,32.2 4.12,30.05 5.42,28.75 10.47,28.75 11.32,27.9 14.92,27.9 15.92,26.9 16.07,26.9 v16.47,26.5
EXTI14  (via drill 0.2)
  Top 0.15: v15.92,26.5 IC1.E1
  Bottom 0.15: JP4.9 1.28,30.6 2.92,30.6 3.62,29.9 3.62,29.65 5.67,27.6 14.82,27.6 v15.92,26.5
EXTI15  (via drill 0.2)
  Top 0.15: v14.82,26.25 15.27,25.8 IC1.F1
  Bottom 0.15: JP4.12 4.53,27.35 13.72,27.35 v14.82,26.25
FLASH_CLK  (via drill 0.2)
  Top 0.15: IC9.6 16.6,33.88 v16.62,33.9 | v11.57,26.5 11.57,26.15 12.02,25.7 IC1.L1
  InnerTop 0.15: v11.57,26.5 11.57,30.7 14.77,33.9 v16.62,33.9
FLASH_DQ0  (via drill 0.2)
  Top 0.13: IC1.L3 12.35,24.43 12.35,25.95
  Top 0.15: IC9.5 16.81,35.15 17.02,34.95 v17.02,33.45 | 12.35,25.95 v12.05,26.25
  InnerTop 0.15: v12.05,26.25 12.05,30.72 14.77,33.45 v17.02,33.45
FLASH_DQ1  (via drill 0.2)
  Top 0.13: IC1.L2 11.69,25.08 11.69,25.58
  Top 0.15: IC9.2 20.48,32.61 v20.47,32.6 | 11.69,25.58 11.12,26.15 v11.12,26.25
  InnerTop 0.15: v11.12,26.25 11.12,30.7 14.82,34.4 18.67,34.4 v20.47,32.6
FLASH_DQ2  (via drill 0.2)
  Top 0.15: IC9.3 20.48,33.88 v20.47,33.9 | v20.82,25.3 19.07,25.3 IC1.A2
  InnerTop 0.15: v20.47,33.9 21.02,33.35 21.02,25.5 v20.82,25.3
FLASH_DQ3  (via drill 0.2)
  Top 0.13: IC1.K2 13,25.08 13,25.62
  Top 0.15: IC9.7 15.31,32.65 v16.62,32.65 | v13.22,26.5 13.22,25.85 13,25.62
  InnerTop 0.15: v13.22,26.5 13.22,26.95 12.77,27.4 12.77,31 14.42,32.65 v16.62,32.65
FLASH_NCS  (via drill 0.2)
  Top 0.15: IC9.1 22.08,30.65 v22.02,30.65 | IC1.J15 13.02,16 13.02,14.91 v12.61,14.51
  InnerTop 0.15: v22.02,30.65 21.77,30.4 21.77,16.8 23.53,15.04 23.97,15.04 v24.27,14.74
  Bottom 0.15: v24.27,14.74 23.96,15.05 16.07,15.05 15.52,14.5 v12.62,14.5 v12.61,14.51
GND  (via drill 0.2)
  Top 0.15: IC2.P8 8.77,6.9 6.52,6.9 C2.2 | IC1.F2 v14.97,25.05 14.92,25.05 IC1.G2 | IC1.J7 v13.64,21.18 IC1.H8 | IC1.H8 v14.29,20.52 v14.3,20.52 IC1.G9 | IC1.G7 v14.3,21.18 IC1.H8 | IC1.J9 v13.64,20.52 IC1.H8 | IC2.B8 18.37,6.9 18.37,6.15 | IC2.N1 9.92,12.9 9.57,12.55 9.57,11.7 IC2.P3 IC2.R3 | IC1.L4 12.07,23.4 12.07,22.6 12.52,22.15 IC1.K6 | C10.2 10.27,14.25 10.49,14.02 10.49,13.3 v10.39,13.2 | IC2.L3 v11.57,10.6 | IC2.L9 11.07,6 C3.2 11.66,4.95 v11.76,4.84 | 20.38,11.3 IC2.A3 IC2.B3 v18.37,11.7 17.56,11.7 | IC1.D9 16.35,20.2 v16.03,20.52 v16.02,20.52 16.35,20.85 IC1.D8 | IC1.H12 v14.27,18.55 14.57,18.25 IC1.G12 14.67,18.3 15.22,18.3 IC1.F12 | 17.56,11.7 17.56,12.9 IC2.C1 | 17.56,11.7 v17.56,10.81 v17.57,10.8 | IC1.D5 15.92,22.8 IC1.F6 | v1.92,20.7 2.17,20.45 C40.2 | C20.2 16.25,14.4 16.35,14.3 16.35,13.62 15.62,12.9 IC2.F1 | IC1.M8 v11.68,20.54
  Top 0.254: v4.62,5.95 4.62,5.61 L1.2 4.97,5.35 4.97,4.7 v5.62,4.7 | CN1.G3 15.49,38.7 15.42,38.77 CN1.5
  Top 0.305: C39.2 11.58,31.96 11.37,31.75 11.37,31.73 U3.1 v9.68,31.66
  Bottom 0.2: v7.49,21.15 7.49,21.72 8.52,22.75 10.33,22.75 11.38,21.7 11.87,21.7 12.12,21.45 12.12,20.98 v11.68,20.54
  other vias: 8.15,33.94 7.6,39.14 7.6,37.99 18.42,13.35 17.32,36.45 24.27,18.25 24.02,20.25 23.97,22.45 24.02,24.7 6.09,22.6 3.22,18.3 20.42,26.25 14.82,9.8 18.27,9.5 24.02,13.4 24.12,26.8 20.17,29.35 18.82,33.3 20.22,39 1.25,40.74 3.9,36.64 3.12,15.6 16.62,9.75
  pour Top: -1.27,43.8 28.97,43.8 28.97,13 24.77,13 23.67,11.9 23.67,6.87 21.03,4.19 5.18,4.26 4.27,5.19 4.27,11.96 3.15,13.03 -1.27,13.07
  pour Bottom: -1.27,43.8 28.97,43.8 28.97,13 24.77,13 23.67,11.9 23.67,6.88 21.03,4.19 5.19,4.26 4.27,5.19 4.27,11.96 3.15,13.03 -1.27,13.07
  pour InnerBottom: -1.27,43.8 28.97,43.8 28.97,13 24.77,13 23.67,11.9 23.67,6.88 21.03,4.19 5.19,4.26 4.27,5.19 4.27,11.96 3.15,13.03 -1.27,13.07
I2C_SCL  (via drill 0.2)
  Top 0.15: IC1.A5 19.92,22.8 20.62,23.5 v24.02,23.5
  InnerTop 0.15: v24.02,23.5 24.27,23.5 24.77,23 26.27,23 26.67,22.6 26.67,15.37 JP5.23
I2C_SDA  (via drill 0.2)
  Top 0.13: IC1.B5 18.2,23.13 19.9,23.13
  Top 0.15: 19.9,23.13 20.52,23.75 23.67,23.75 v24.02,24.1
  InnerTop 0.15: JP5.24 26.92,15.12 26.92,22.75 26.42,23.25 24.87,23.25 v24.02,24.1
LPTIM1_CH1  (via drill 0.2)
  Top 0.15: IC1.B8 v18.19,20.53 | JP4.17 1.04,22.75 1.04,25.16 1.32,25.45 1.32,29.85 2.07,30.6 6.02,30.6 6.18,30.76 v6.21,30.76
  Bottom 0.15: v18.19,20.53 18.26,20.6 23.27,20.6 24.37,21.7 24.37,22.1 25.27,23 25.87,23 26.57,23.7 26.57,27.5 26.07,28 17.97,28 15.22,30.75 6.25,30.75 6.24,30.76 v6.21,30.76
LPTIM1_CH2  (via drill 0.2)
  Top 0.13: IC1.B9 18.2,19.87 18.71,19.87
  Top 0.15: v20.42,20.17 19.02,20.17 18.71,19.87 | JP4.18 2.54,22.77 3.87,24.1 3.87,25.45 v5.12,26.7
  InnerBottom 0.15: v6.2,31.41 5.4,31.41 5.12,31.13 v5.12,26.7
  Bottom 0.15: v20.42,20.17 20.54,20.3 23.37,20.3 23.77,20.7 26.12,20.7 26.67,21.25 26.67,23.4 26.82,23.55 26.82,27.65 26.22,28.25 18.07,28.25 15.27,31.05 6.57,31.05 v6.2,31.41
N$1  (via drill 0.2)
  Top 0.15: C14.1 6.88,19.4 v7.47,19.4 | IC1.M10 v11.05,19.23 v11.04,19.23
  Bottom 0.2: v7.47,19.4 9.89,19.4 10.13,19.64 10.63,19.64 v11.04,19.23
N$11
  Top 0.13: IC1.F13 15.6,17.27 15.6,15.82
  Top 0.152: 15.6,15.82 16.97,14.45 17.52,14.45 C13.1
N$12
  Top 0.15: 13.32,28.04 14.63,28.04 14.97,27.7 14.97,27.4 14.17,26.6 14.17,25.6 IC1.H1
  Top 0.2: Y1.1 13.32,28.04 13.47,28.04 12.84,27.41 C23.1
N$15
  Top 0.15: Y1.2 15.91,28.04 15.42,27.55 15.42,27.45 14.42,26.45 14.42,25.6 IC1.G1
  Top 0.2: Y1.2 17.27,28.04 17.94,27.37 C22.1
NRST  (via drill 0.2)
  Top 0.15: v13.77,26.5 13.57,26.3 13.57,25.65 IC1.J1 | C26.1 v20.67,36.35 18.02,36.35 17.42,35.75 17.42,32.6 v17.07,32.25
  InnerTop 0.15: v13.77,26.5 13.77,26.85 13.12,27.5 13.12,30.95 14.42,32.25 v17.07,32.25
  Bottom 0.2: J1.10 21.93,36.35 v20.67,36.35
PDR_ON  (via drill 0.2)
  Top 0.152: IC1.C6 v16.92,21.85
  Bottom 0.15: BOOT1.2 20.42,21.1 19.67,21.85 v16.92,21.85
RAM_!CAS  (via drill 0.2)
  Top 0.13: v19.67,21.2 19.64,21.17 18.2,21.17 IC1.B7
  Top 0.15: IC2.K7 v12.77,7.7
  InnerTop 0.15: v19.67,21.2 19.67,20.85 19.52,20.7 19.52,19.56 19.02,19.05 19.02,18.74 19.14,18.61 19.14,17.37 22.62,13.9 22.62,8.05 19.87,5.3 13.72,5.3 13.15,5.87 13.15,6.3 12.77,6.68 v12.77,7.7
RAM_!CS  (via drill 0.2)
  Top 0.15: IC2.J8 12.77,6.9 v12.77,6.1 | v14.94,23.76 IC1.G4
  InnerTop 0.15: v19.39,18.9 19.39,17.52 22.87,14.04 22.87,7.95 19.97,5.05 13.57,5.05 12.77,5.85 v12.77,6.1
  InnerBottom 0.15: v14.94,23.76 13.82,24.89 13.82,25.35 14.15,25.67 18.19,25.67 18.77,25.09 18.77,23.59 19.22,23.14 19.22,19.07 v19.39,18.9
RAM_!RAS  (via drill 0.2)
  Top 0.15: IC2.J9 v13.57,6.1 | IC1.R6 9.39,22.12 8.22,22.12 8.02,21.92 v8.02,21.32
  InnerBottom 0.15: v7.57,7.3 7.42,7.45 7.42,12.5 8.12,13.2 8.12,17.85 7.87,18.1 7.87,21.07 8.02,21.22 v8.02,21.32
  Bottom 0.15: v13.57,6.1 13.06,5.59 9.83,5.59 8.12,7.3 v7.57,7.3 | v7.57,7.3
RAM_!WE  (via drill 0.2)
  Top 0.15: IC2.K8 v11.97,7.7 | IC1.J4 12.87,23 12.62,23 v12.47,22.85
  InnerTop 0.15: v8.67,8.5 9.17,9 9.17,14.64 9.07,14.74 9.07,18.86 9.66,19.46 9.93,19.46 10.57,20.1 12.02,20.1 12.22,20.3 12.22,22.6 v12.47,22.85
  Bottom 0.15: v11.97,7.7 11.59,7.32 10.21,7.32 10.19,7.35 9.82,7.35 v8.67,8.5
RAM_A0  (via drill 0.2)
  Top 0.13: IC1.E2 15.6,25.07 15.6,26.23
  Top 0.15: IC2.G8 v14.37,6.9 | 15.6,26.23 15.54,26.29 15.54,26.3 v15.32,26.52
  InnerBottom 0.15: v14.37,6.9 14.75,6.52 14.75,6.04 15.04,5.75 17.27,5.75 22.62,11.09 22.62,15 19.77,17.85 19.77,20.3 20.07,20.6 20.07,22.65 19.02,23.7 19.02,25.2 18.12,26.1 15.72,26.1 15.32,26.5 v15.32,26.52
RAM_A1  (via drill 0.2)
  Top 0.13: v14.3,25.08 14.3,24.42 IC1.H3
  Top 0.15: v15.17,6.15 14.82,6.5 IC2.G9
  InnerBottom 0.15: v15.17,6.15 17.32,6.15 21.77,10.6 21.77,15.5 18.97,18.3 18.97,23 18.52,23.45 18.52,24.99 18.09,25.42 14.64,25.42 v14.3,25.08
RAM_A2  (via drill 0.2)
  Top 0.15: IC2.F7 v15.57,8.6 | IC1.H2 v13.67,24.45
  InnerTop 0.15: v15.57,8.6 15.57,10.55 14.77,11.35 14.77,13.45 13.52,14.7 13.52,16.54 13.89,16.91 13.89,17.68 12.97,18.6 12.97,21.64 13.77,22.44 13.77,24.35 v13.67,24.45
RAM_A3  (via drill 0.2)
  Top 0.15: IC2.F3 v15.17,11.7 | IC1.J2 v13.01,24.45
  InnerBottom 0.15: v15.17,11.7 15.17,11.73 14.78,12.12 14.25,12.12 13.77,12.6 13.77,14.52 14.34,15.1 14.34,16.08 13.64,16.78 13.64,17.75 12.22,19.17 12.22,22.45 12.07,22.6 12.07,23.05 12.27,23.25 13.12,23.25 13.37,23.5 13.37,24.09 v13.01,24.45
RAM_A4  (via drill 0.2)
  Top 0.13: IC1.J3 13.65,23.77 13.65,23.23 v13.37,22.95
  Top 0.15: IC2.G1 v14.37,13.3
  InnerTop 0.15: v14.37,13.3 14.32,13.3 13.27,14.35 13.27,16.65 13.63,17.01 13.63,17.54 12.72,18.45 12.72,21.75 13.37,22.4 v13.37,22.95
RAM_A5  (via drill 0.2)
  Top 0.15: IC1.K3 v12.35,23.78 | IC2.G2 15.17,12.5 v15.17,13.3
  InnerTop 0.15: v15.17,13.3 15.02,13.45 15.02,13.55 14.27,14.3 14.27,15.45 14.27,15.46 14.27,17.65 13.22,18.7 13.22,21.54 14.07,22.39 14.07,24.6 13.77,24.9 12.62,24.9 12.35,24.63 v12.35,23.78
RAM_A6  (via drill 0.2)
  Top 0.15: v10.4,21.82 IC1.P6 | IC2.G3 14.42,10.95 v14.37,10.95
  InnerTop 0.15: v10.4,21.82 9.34,20.76 9.34,19.49 8.82,18.97 8.82,14.64 8.92,14.54 8.92,12.38 8.39,11.85 8.39,11.14 8.69,10.85 v8.72,10.85
  Bottom 0.15: v8.72,10.85 9.37,10.2 12.22,10.2 13.35,11.32 13.99,11.32 v14.37,10.95
RAM_A7  (via drill 0.2)
  Top 0.13: 11.55,21.83 11.04,21.83
  Top 0.15: v11.82,22.1 11.55,21.83 | IC1.N6 11.04,21.83 | v14.37,12.55 14.02,12.9 IC2.H1
  InnerTop 0.15: v11.82,22.1 v11.81,22.1 11.21,22.7 7.66,22.7 6.52,21.55 6.52,10 v7.87,8.65
  Bottom 0.15: v14.37,12.55 14.77,12.15 14.77,10.75 13.32,9.3 12.68,9.3 12.41,9.57 8.46,9.57 8.27,9.38 8.27,9.05 v7.87,8.65
RAM_A8  (via drill 0.2)
  Top 0.15: v14.32,11.7 13.97,12.05 IC2.H2
  Top 0.152: IC1.R7 9.42,21.55 9.27,21.7 v8.42,21.7
  InnerBottom 0.15: v8.42,21.7 9.34,21.7 13.39,17.64 13.39,16.68 13.52,16.55 13.52,12.5 v14.32,11.7
RAM_A9  (via drill 0.2)
  Top 0.15: IC1.P7 v9.76,21.81 | IC2.J3 13.52,10.95 v13.55,10.95
  InnerTop 0.15: v9.76,21.81 9.76,21.79 9.09,21.13 9.09,19.62 8.57,19.1 8.57,12.38 8.12,11.93 8.12,10.68 8.25,10.55 8.25,10.42 v8.72,9.95
  Bottom 0.15: v8.72,9.95 12.55,9.95 v13.55,10.95
RAM_A10  (via drill 0.2)
  Top 0.15: IC1.N7 v11.04,21.18 | v14.77,8.6 IC2.G7
  InnerTop 0.15: v11.04,21.18 11.04,21.77 10.61,22.2 7.87,22.2 7.07,21.39 7.07,20.15 7.32,19.9 7.77,19.9 8.32,19.35 8.32,13.4 7.47,12.55 7.47,10.2 8.52,9.14 v8.72,9.14
  Bottom 0.15: v14.77,8.6 14.32,8.15 9.72,8.15 v8.72,9.14
RAM_A11  (via drill 0.2)
  Top 0.15: IC2.H9 v13.57,6.9 | v11.66,21.19 IC1.M7
  InnerTop 0.15: v11.66,21.19 11.66,21.58 10.8,22.45 7.77,22.45 6.77,21.45 6.77,10.3 v7.87,9.2
  Bottom 0.15: v7.87,9.2 7.42,8.75 7.42,7.95 7.67,7.7 8.22,7.7 9.42,6.5 13.17,6.5 v13.57,6.9
RAM_A12  (via drill 0.2)
  Top 0.15: IC2.H3 13.97,10.8 v12.87,9.7 | IC1.L15 12.02,15.65 v11.77,15.4
  InnerBottom 0.15: v12.87,9.7 12.42,10.15 12.42,13.25 11.77,13.9 v11.77,15.4
RAM_BA0
  Top 0.13: IC1.K14 12.35,16.63 12.35,15.53
  Top 0.15: 12.35,15.53 12.22,15.4 12.22,14.1 12.77,13.55 12.77,10.19 12.47,9.89 12.47,9.53 13.15,8.85 13.15,8.12 IC2.J7
RAM_BA1  (via drill 0.2)
  Top 0.15: IC2.H8 13.57,7.7 13.57,8.3 v13.92,8.65
  Top 0.152: v12.35,17.27 12.35,17.29 IC1.K13
  InnerBottom 0.15: v13.92,8.65 13.92,9.95 13.17,10.7 13.17,12.8 13.27,12.9 13.27,16.35 v12.35,17.27
RAM_CLK
  Top 0.13: IC1.H14 13.65,16.63 13.65,16.08
  Top 0.15: 13.65,16.08 13.32,15.75 13.32,13.05 IC2.J1
RAM_CLKE  (via drill 0.2)
  Top 0.15: IC2.J2 v13.57,11.7 | IC1.F4 14.87,23.05 14.87,22.8 14.63,22.56 v12.91,22.56
  InnerTop 0.15: v13.57,11.7 13.57,13.65 13.02,14.2 13.02,16.76 13.38,17.12 13.38,17.44 12.47,18.35 12.47,22.1 v12.92,22.55 v12.91,22.56
RAM_D0  (via drill 0.2)
  Top 0.15: IC1.M14 v11.06,16.64 v11.05,16.64 | v10.1,9.01 10.1,8.98 9.57,8.45 9.57,7.85 9.38,7.66 8.73,7.66 IC2.R8
  InnerBottom 0.15: v11.05,16.64 10.39,15.98 10.39,14.17 11.05,13.52 11.05,11.02 10.1,10.08 v10.1,9.01
RAM_D1  (via drill 0.2)
  Top 0.13: IC1.L14 11.69,16.62 11.69,15.92
  Top 0.15: 11.69,15.92 11.27,15.5 v11.27,15.2 | IC2.N7 9.97,8.3 v10.67,9
  InnerBottom 0.15: v10.67,9 10.67,10.25 11.32,10.9 11.32,13.65 11.27,13.7 v11.27,15.2
RAM_D2  (via drill 0.2)
  Top 0.15: IC2.R9 v9.04,5.82 | IC1.B12 v18.19,18.57
  InnerTop 0.15: v18.19,18.57 18.19,16.62 17.81,16.24 17.81,15.81 18.03,15.59 19.87,15.59 21.52,13.94 21.52,7.3 19.91,5.7 v14.07,5.7
  Bottom 0.15: v9.04,5.82 9.61,5.26 13.63,5.26 v14.07,5.7
RAM_D3  (via drill 0.2)
  Top 0.15: IC2.N8 v10.37,6.9 | IC1.C12 v17.54,18.57
  InnerTop 0.15: v17.54,18.57 17.92,18.19 17.92,16.7 17.56,16.34 17.56,15.7 17.93,15.34 19.77,15.34 21.27,13.84 21.27,7.4 19.81,5.95 16.07,5.95 15.47,6.55 14.77,6.55 v14.37,6.15
  Bottom 0.15: v10.37,6.9 12.17,6.9 12.57,7.3 13.77,7.3 13.97,7.1 13.97,6.55 v14.37,6.15
RAM_D4  (via drill 0.2)
  Top 0.15: IC2.P9 v9.57,6.9 | IC1.R8 v8.27,20.85
  InnerBottom 0.15: v9.57,6.9 8.57,6.9 8.22,7.25 8.27,7.3 8.27,11.84 8.37,11.94 8.37,17.95 8.12,18.2 8.12,20.7 v8.27,20.85
RAM_D5  (via drill 0.2)
  Top 0.13: IC1.P8 9.75,21.17 8.8,21.17
  Top 0.15: 8.8,21.17 v8.72,21.25 | IC2.M8 v10.37,7.7
  InnerBottom 0.15: v10.37,7.7 9.65,7.7 9.4,7.95 9.4,11.97 8.87,12.5 8.87,18.25 8.68,18.44 8.68,19.96 8.9,20.18 8.9,20.71 8.72,20.9 v8.72,21.25
RAM_D6  (via drill 0.2)
  Top 0.15: IC1.P9 v9.75,20.52 | IC2.M7 10.77,8.25 v11.07,8.55
  InnerBottom 0.15: v11.07,8.55 9.97,8.55 9.67,8.85 9.67,12.05 9.12,12.6 9.12,18.35 8.93,18.54 8.93,19.69 v9.75,20.52
RAM_D7  (via drill 0.2)
  Top 0.15: IC2.L8 v11.17,7.7 | IC1.R9 8.72,20.2 v8.53,20.39
  InnerBottom 0.15: v8.53,20.39 8.43,20.29 8.43,18.29 8.62,18.1 8.62,12.4 9.15,11.87 9.15,7.82 9.65,7.32 10.79,7.32 v11.17,7.7
RAM_D8  (via drill 0.2)
  Top 0.15: IC2.L2 11.17,11.7 11.17,11.05 10.72,10.6 v10.07,10.6 | IC1.P10 v10.39,19.23
  InnerTop 0.15: v10.39,19.23 10.36,19.2 9.77,19.2 9.32,18.75 9.32,14.85 9.42,14.75 9.42,11.25 v10.07,10.6
RAM_D9  (via drill 0.2)
  Top 0.15: IC2.M3 10.47,11 v10.42,11 | IC1.R10 v9.75,19.87
  InnerBottom 0.15: v9.75,19.87 9.19,19.31 9.19,18.63 9.37,18.45 9.37,12.75 9.97,12.15 9.97,11.44 v10.42,11
RAM_D10  (via drill 0.2)
  Top 0.15: IC2.M2 v10.37,11.7
  Top 0.152: v11.03,18.59 IC1.N11
  InnerBottom 0.15: v10.37,11.7 IC2.M2 10.77,13.4 10.12,14.05 10.12,17 11.03,17.91 v11.03,18.59
RAM_D11  (via drill 0.2)
  Top 0.15: v10.02,13.55 9.82,13.55 IC2.P1 | v10.39,18.58 IC1.P11
  InnerBottom 0.15: v10.02,13.55 9.87,13.7 9.87,18.06 v10.39,18.58
RAM_D12  (via drill 0.2)
  Top 0.15: IC2.N2 v10.32,12.45 | IC1.R11 v9.73,18.59
  InnerBottom 0.15: v9.73,18.59 9.73,18.31 9.62,18.2 9.62,12.9 10.07,12.45 v10.32,12.45
RAM_D13
  Top 0.15: IC1.P15 10.07,16.1 9.17,15.2 9.17,14.85 8.37,14.05 IC2.R1
RAM_D14  (via drill 0.2)
  Top 0.13: IC1.P14 9.74,16.62 9.74,16.17 8.92,15.35
  Top 0.15: IC2.N3 9.07,10.4 v7.87,10.4 | 8.92,15.35 8.92,15 7.87,13.95 v7.87,12.35
  InnerBottom 0.15: v7.87,12.35 v7.87,10.4
RAM_D15
  Top 0.15: IC2.R2 8.77,12.5 8.77,14.05 9.42,14.7 9.42,15.05 10.67,16.3 IC1.N15
RAM_D16  (via drill 0.2)
  Top 0.15: IC1.M12 v11.72,18.6 | IC2.E8 15.97,7.7 v15.97,9
  InnerTop 0.15: v11.42,9.05 11.42,10.15 10.79,10.77 10.79,13.33 9.67,14.45 9.67,14.85 9.57,14.95 9.57,16.45 v11.72,18.6
  Bottom 0.15: v11.42,9.05 11.44,9.02 15.94,9.02 v15.97,9
RAM_D17  (via drill 0.2)
  Top 0.15: IC2.D7 v17.17,8.65
  Top 0.152: IC1.M13 v11.05,17.28
  InnerBottom 0.15: v11.05,17.28 12.22,16.11 12.22,13.85 12.67,13.4 12.67,10.45 13.27,9.85 13.27,8.34 13.74,7.87 16.42,7.87 17.17,8.62 v17.17,8.65
RAM_D18  (via drill 0.2)
  Top 0.15: IC2.D8 16.77,7.7 16.77,8.37 v16.5,8.65
  Top 0.152: IC1.L13 v11.7,17.28
  InnerBottom 0.15: v11.7,17.28 13.02,15.96 13.02,13 12.92,12.9 12.92,10.59 13.52,9.99 13.52,8.45 13.85,8.12 15.98,8.12 v16.5,8.64 v16.5,8.65
RAM_D19  (via drill 0.2)
  Top 0.15: v15.37,18.75 14.92,19.2 12.97,19.2 IC1.L12 | IC2.B9 v19.17,6.9
  InnerTop 0.15: v19.17,6.9 19.07,7 19.07,13.44 18.71,13.8 17.31,13.8 15.36,15.75 v15.36,18.74 v15.37,18.75
RAM_D20  (via drill 0.2)
  Top 0.15: IC2.C8 v17.62,7.65 | IC1.K12 13.22,18.8 v13.67,18.8
  InnerBottom 0.15: v17.62,7.65 17.62,10.2 15.57,12.25 15.57,12.83 16.35,13.61 16.35,14.85 15.03,16.17 14.64,16.17 13.89,16.93 13.89,17.98 13.67,18.2 v13.67,18.8
RAM_D21  (via drill 0.2)
  Top 0.15: v15.66,19.2 15.82,19.04 15.82,18.35 IC1.E12 | v20.07,7.35 20.07,7 IC2.A9
  InnerTop 0.15: v20.07,7.35 19.32,8.1 19.32,13.54 18.82,14.05 17.42,14.05 15.61,15.85 15.61,18.42 15.78,18.59 15.77,18.6 15.77,19.09 v15.66,19.2
RAM_D22  (via drill 0.2)
  Top 0.13: v17.54,17.93 v17.53,17.92 16.24,17.92 IC1.E13
  Top 0.15: IC2.C7 17.97,8.11 v18.29,8.43
  InnerBottom 0.15: v17.54,17.93 18.54,17.93 21.27,15.2 21.27,10.86 18.84,8.43 v18.29,8.43
RAM_D23  (via drill 0.2)
  Top 0.15: IC1.D13 v16.24,17.27 | IC2.A8 19.57,7.4 20.07,7.9 v20.07,7.92
  InnerTop 0.15: v20.07,7.92 19.57,8.42 19.57,13.65 18.92,14.3 17.52,14.3 15.86,15.96 15.86,16.89 v16.24,17.27
RAM_D24  (via drill 0.2)
  Top 0.15: IC2.A2 v19.97,12.1 | v16.25,16.63 IC1.E14
  InnerTop 0.15: v19.97,12.1 19.97,13.68 19.1,14.55 17.65,14.55 16.25,15.95 v16.25,16.63
RAM_D25  (via drill 0.2)
  Top 0.15: v19.97,10.9 18.37,10.9 IC2.C3 | v16.89,16.63 IC1.D14
  InnerTop 0.15: v16.89,16.63 17.06,16.46 17.06,15.49 17.75,14.8 19.2,14.8 20.47,13.53 20.47,11.95 19.97,11.45 v19.97,10.9
RAM_D26  (via drill 0.2)
  Top 0.13: v18.2,15.97 17.7,15.97 17.54,16.13 17.54,16.63
  Top 0.15: v22.22,12.8 21.97,12.8 21.87,12.9 IC2.A1 | IC1.C14 17.54,16.63
  InnerTop 0.15: v18.2,15.97 19.84,15.97 21.77,14.04 21.77,13.04 22.01,12.8 v22.22,12.8
RAM_D27  (via drill 0.2)
  Top 0.15: v20.87,12.45 20.82,12.5 18.37,12.5 IC2.C2 | v17.54,17.27 IC1.C13
  InnerTop 0.15: v17.54,17.27 17.54,16.67 17.31,16.44 17.31,15.6 17.82,15.09 19.66,15.09 20.87,13.88 v20.87,12.45
RAM_D28  (via drill 0.2)
  Top 0.13: 19.42,23.78 17.73,23.78 17.41,24.1 IC1.C3
  Top 0.15: v19.42,23.85 19.42,23.78 | IC2.B1 19.22,13.35 v22.22,13.35
  InnerTop 0.15: v19.42,23.85 19.42,21.55 19.27,21.4 19.27,19.66 18.77,19.16 18.77,18.64 18.89,18.51 18.89,17.27 22.22,13.94 v22.22,13.35
RAM_D29  (via drill 0.2)
  Top 0.15: v16.77,12.5 IC2.D2 | IC1.C2 v16.92,24.45
  InnerBottom 0.15: v16.77,12.5 17.72,13.45 17.72,15.25 17.35,15.62 16.31,15.62 15.57,16.36 15.57,17.5 16.42,18.35 16.42,18.85 16.73,19.16 16.73,20.74 16.25,21.22 16.25,23.12 16.92,23.8 v16.92,24.45
RAM_D30  (via drill 0.2)
  Top 0.13: IC1.D3 16.89,23.78 17.34,23.78 17.55,23.57 v17.55,23.13
  Top 0.15: v18.57,10.3 17.42,10.3 17.17,10.55 IC2.D3
  InnerBottom 0.13: 17.42,16.75 16.92,17.25
  InnerBottom 0.15: v18.57,10.3 19.57,11.3 19.57,16.35 19.17,16.75 17.42,16.75 | 16.92,17.25 16.92,18.6 17.25,18.93 17.25,20.92 17.09,21.08 17.09,21.37 17.55,21.83 v17.55,23.13
RAM_D31  (via drill 0.2)
  Top 0.15: IC2.E2 v15.97,12.5 | v15.62,23.8 IC1.E3
  InnerBottom 0.15: v15.97,12.5 16.39,12.92 16.84,12.92 17.47,13.55 17.47,15.1 17.2,15.37 16.2,15.37 15.32,16.25 15.32,17.65 16.17,18.5 16.17,19 16.48,19.31 16.48,20.63 15.97,21.14 15.97,23.39 15.62,23.74 v15.62,23.8
RAM_M0  (via drill 0.2)
  Top 0.15: IC2.K9 v11.97,6.1
  Top 0.152: IC1.A4 19.67,23.45 v20.32,24.1
  InnerTop 0.15: v20.32,24.1 20.32,20.7 20.02,20.4 20.02,17.6 23.37,14.25 23.37,7.7 20.22,4.55 13.35,4.55 11.97,5.93 v11.97,6.1
RAM_M1  (via drill 0.2)
  Top 0.15: v12.37,8.65 11.97,9.05 11.97,12.5 IC2.K1
  Top 0.152: IC1.A3 19.07,24.1 19.22,24.25 19.77,24.25 v19.82,24.3
  InnerTop 0.15: v19.82,24.3 19.82,21.7 20.07,21.45 20.07,20.85 19.77,20.55 19.77,17.49 23.12,14.14 23.12,7.8 20.12,4.8 13.46,4.8 13.18,5.07 13.18,5.08 12.39,5.87 12.39,6.47 12.37,6.5 v12.37,8.65
RAM_M2  (via drill 0.2)
  Top 0.13: IC1.D4 v16.24,23.78
  Top 0.15: IC2.F8 v15.22,6.95
  InnerBottom 0.15: v15.22,6.95 15.67,6.5 17.3,6.5 21.52,10.71 21.52,15.35 18.7,18.17 18.7,22.92 18.27,23.34 18.27,24.8 17.92,25.15 16.67,25.15 16.24,24.72 v16.24,23.78
RAM_M3  (via drill 0.2)
  Top 0.13: 17.22,23.4 16.95,23.13
  Top 0.15: v16.77,11.75 16.72,11.7 16.02,11.7 15.62,12.1 IC2.F2 | v16.89,23.13 16.95,23.13 | 17.22,23.4 IC1.C4
  InnerBottom 0.15: v16.77,11.75 17.97,12.95 17.97,15.35 17.45,15.87 16.42,15.87 15.82,16.47 15.82,17.39 16.67,18.24 16.67,18.75 16.99,19.07 16.99,20.83 16.5,21.32 16.5,22.73 v16.89,23.13
SAI_BCK  (via drill 0.2)
  Top 0.13: IC1.B2 18.2,25.08 18.2,25.97 v17.57,26.6
  InnerBottom 0.15: v17.57,26.6 16.97,27.2 7.97,27.2 5.42,24.65 5.42,6.39 6.62,5.19 6.62,4.05 8.12,2.55 9.21,1.4 JP3.3
SAI_LRCK  (via drill 0.2)
  Top 0.15: v17.02,26.5 17.02,26.25 IC1.B1
  InnerBottom 0.15: v17.02,26.5 17.02,26.65 16.77,26.9 8.07,26.9 5.67,24.5 5.67,6.49 6.9,5.27 6.9,4.25 8.43,2.71 10.75,2.71 12.07,1.4 JP3.4
SAI_MCLK  (via drill 0.2)
  Top 0.15: IC1.J14 v12.99,17.27 | JP3.5 14.63,1.4 12.18,3.84 v12.18,4.3
  InnerBottom 0.15: v7.72,16.62 7.39,16.62 6.92,16.15 6.92,7.01 8.32,5.61 8.32,5.06 9.19,4.2 12.08,4.2 v12.18,4.3
  Bottom 0.15: v7.72,16.62 9.72,16.62 10.82,17.72 12.54,17.72 v12.99,17.27
SAI_SDI  (via drill 0.2)
  Top 0.13: IC1.B3 18.19,24.42 18.78,24.42
  Top 0.15: v19.42,24.75 19.12,24.75 18.78,24.42
  InnerBottom 0.15: v19.42,24.75 19.77,25.1 19.77,26.45 18.52,27.7 7.67,27.7 4.92,24.95 4.92,6.18 6.07,5.04 6.07,2.38 JP3.1
SAI_SDO  (via drill 0.2)
  Top 0.15: IC1.A1 v19.37,26.25
  InnerBottom 0.15: v19.37,26.25 18.17,27.45 7.81,27.45 5.17,24.8 5.17,6.29 6.37,5.09 6.37,3.82 7.62,2.57 JP3.2
SPI3_MISO  (via drill 0.2)
  Top 0.13: IC1.B13 18.2,17.93 19.79,17.93
  Top 0.15: v24.88,17.66 24.08,17.66 23.87,17.45 20.27,17.45 19.79,17.93
  Bottom 0.15: JP5.20 26.96,18.2 25.92,18.2 25.38,17.66 v24.88,17.66
SPI3_MOSI  (via drill 0.2)
  Top 0.15: IC1.A12 18.77,18.5 20.47,18.5 20.82,18.85 24.22,18.85 25.27,17.8 v26.07,17.8
  Bottom 0.15: v26.07,17.8 26.78,17.8 JP5.22
SPI3_SCK  (via drill 0.2)
  Top 0.13: IC1.B14 18.19,17.27 19.2,17.27
  Top 0.15: 19.2,17.27 19.82,16.65 21.82,16.65 22.37,17.2 v24.37,17.2
  Bottom 0.15: v24.37,17.2 24.37,17.8 24.67,18.1 24.67,18.4 24.32,18.75 24.32,19.5 25.02,20.2 26.42,20.2 JP5.18
SPI6_MISO
  Top 0.15: JP5.19 25.4,20.13 24.58,20.95 20.42,20.95 19.97,20.5 18.82,20.5 IC1.A9
SPI6_MOSI
  Top 0.15: IC1.A7 18.61,21.59 21.08,21.59 21.17,21.5 23.77,21.5 25.02,22.75 25.89,22.75 26.45,22.19 26.45,17.43 25.65,16.64 JP5.21
SPI6_SCK
  Top 0.15: IC1.A8 18.75,20.85 18.85,20.75 19.82,20.75 20.32,21.25 24.93,21.25 JP5.17
SWDCLK  (via drill 0.2)
  Top 0.15: v22.57,16.6 22.37,16.4 19.67,16.4 19.12,16.95 IC1.A14
  InnerTop 0.15: v23.49,33.25 23.49,31.57 22.02,30.1 22.02,17.15 v22.57,16.6
  Bottom 0.15: v23.49,33.25 23.52,33.25 22.9,32.63 J1.4
SWDIO  (via drill 0.2)
  Top 0.15: IC1.A15 18.97,16.3 19.37,15.9 23.87,15.9 v24.27,16.3
  InnerTop 0.15: v24.87,30.75 23.57,29.45 23.57,17.35 24.27,16.65 v24.27,16.3
  Bottom 0.15: J1.2 24.26,31.36 v24.87,30.75
SWO  (via drill 0.2)
  Top 0.15: IC1.A10 18.62,19.45 22.2,19.45 v22.41,19.24
  InnerTop 0.15: v24.02,34.53 24.02,34.5 23.87,34.35 23.87,31.5 22.42,30.05 v22.42,19.25 v22.41,19.24
  Bottom 0.15: J1.6 23.42,33.9 24.02,34.5 v24.02,34.53
TIM2_CH1  (via drill 0.2)
  Top 0.15: IC1.A13 19.29,17.6 19.81,17.07 v21.11,17.07
  InnerTop 0.15: v20.42,34.7 21.27,33.85 21.27,17.5 21.11,17.34 v21.11,17.07
  InnerBottom 0.15: v4.77,25.4 4.67,25.5 4.67,34.55 5.02,34.9 20.22,34.9 v20.42,34.7
  Bottom 0.15: v4.77,25.4 3.62,24.25 3.62,21 2.9,20.28 2.05,20.28 0.95,19.18 JP4.19
TIM2_CH2  (via drill 0.2)
  Top 0.15: IC1.N2 v11.04,25.07
  Bottom 0.15: v11.04,25.07 10.34,25.77 5.73,25.77 3.92,23.96 3.92,20.56 JP4.20
TIM3_CH1  (via drill 0.2)
  Top 0.15: IC1.H15 13.97,15.8 13.9,15.72 v13.9,15.3 | v7.47,14.25 3.87,14.25 v3.67,14.45
  InnerBottom 0.15: v7.47,14.25 7.47,15.35 v7.67,15.55 | v3.67,14.45 2.97,15.15 1.5,15.15 JP4.21
  Bottom 0.15: v13.9,15.3 13.4,15.79 8.56,15.79 8.32,15.55 v7.67,15.55
TIM3_CH2  (via drill 0.2)
  Top 0.15: IC1.G15 14.62,15.8 v14.72,15.7 | JP4.22 3.44,16.64 3.98,16.1 v7.67,16.1
  Bottom 0.15: v14.72,15.7 13.97,15.7 13.57,16.1 v7.67,16.1
TIM4_CH1  (via drill 0.2)
  Top 0.15: IC1.N13 v10.4,17.92 | v1.77,18.1 2.87,18.1 3.47,17.5 v7.72,17.5
  Bottom 0.15: v10.4,17.92 8.14,17.92 v7.72,17.5 | JP4.23 1.07,15.17 1.07,17.4 v1.77,18.1
TIM4_CH2  (via drill 0.2)
  Top 0.15: IC1.M15 11.37,16 v10.77,15.4 | v7.42,17.07 6.99,16.64 3.93,16.64 2.89,17.67 1.94,17.67 v1.77,17.5
  Bottom 0.15: v7.42,17.07 7.24,16.89 7.24,15.22 7.57,14.9 10.27,14.9 v10.77,15.4 | v1.77,17.5 1.42,17.15 1.42,15.22 JP4.24
UART5_RX
  Top 0.15: JP5.15 24.75,23.61 24.75,23.3 24.3,22.85 20.77,22.85 20.07,22.15 IC1.A6
UART5_TX
  Top 0.13: IC1.B6 18.19,22.47 19.99,22.47
  Top 0.15: JP5.13 25.4,25.68 24.41,24.7 24.41,23.34 24.17,23.1 20.62,23.1 19.99,22.47
UART7_RX  (via drill 0.2)
  Top 0.15: IC1.F15 15.27,15.75 15.37,15.65 v15.37,15.2
  Bottom 0.15: JP5.16 26.92,23.24 26.92,21.1 26.27,20.45 24.87,20.45 23.87,19.45 23.87,16.2 22.97,15.3 15.47,15.3 v15.37,15.2
UART7_TX  (via drill 0.2)
  Top 0.15: IC1.K1 v12.67,26.25
  InnerTop 0.15: v26.17,25.35 26.49,25.35 JP5.14
  Bottom 0.15: v26.17,25.35 25.82,25.7 12.92,25.7 12.67,25.95 v12.67,26.25
USBD_D+  (via drill 0.2)
  Top 0.13: 17.89,16.3 18.21,16.62 19.05,16.62
  Top 0.15: v13.97,37.65 CN1.3 | IC1.B15 17.89,16.3 | JP5.7 24.22,35.6 v24.22,36.65 | 19.05,16.62 19.52,16.15 23.27,16.15 v23.47,16.35
  InnerTop 0.15: JP5.7 24.42,33.44 24.42,31.3 23.07,29.95 23.07,17.05 23.47,16.65 v23.47,16.35
  InnerBottom 0.15: v13.97,37.65 14.72,36.9 23.97,36.9 v24.22,36.65
USBD_D-  (via drill 0.2)
  Top 0.15: CN1.2 v13.32,38.05 | IC1.C15 17.22,15.85 17.48,15.59 23.03,15.59 23.17,15.45 v23.72,15.45
  InnerTop 0.15: JP5.5 24.4,35.96 24.4,33.88 24.12,33.6 24.12,31.4 22.82,30.1 22.82,16.9 23.07,16.65 23.07,16.1 v23.72,15.45
  InnerBottom 0.15: v13.32,38.05 14.12,38.05 14.92,37.25 24.76,37.25 25.05,36.96 JP5.5
USBD_ID  (via drill 0.2)
  Top 0.15: CN1.4 14.62,38.05 15.02,37.65 v15.07,37.65 | IC1.D15 16.57,15.66 16.91,15.31 22.87,15.31 23.12,15.06 23.87,15.06 v24.27,15.46
  InnerTop 0.15: v25.87,38.15 26.42,37.6 26.42,32.9 JP5.9 23.32,29.8 23.32,17.2 23.89,16.62 23.89,15.84 v24.27,15.46
  InnerBottom 0.15: v25.87,38.15 24.92,38.15 24.42,37.65 v15.07,37.65
USBD_VBUS  (via drill 0.2)
  Top 0.15: CN1.1 v12.67,38.05 | IC1.E15 15.92,15.85 16.73,15.05 22.75,15.05 23.19,14.61 v23.73,14.61
  InnerTop 0.15: JP5.3 23.12,37.22 23.12,33.55 23.12,33.54 23.12,32.34 21.52,30.75 21.52,16.63 23.53,14.61 v23.73,14.61
  InnerBottom 0.15: v12.67,38.05 13.07,38.45 14.27,38.45 14.67,38.05 23.95,38.05 JP5.3
USBH_D+  (via drill 0.2)
  Top 0.15: IC1.R15 8.67,15.55 8.67,15.2 8.12,14.65 4.64,14.65 4.54,14.75 v4.14,14.75
  InnerBottom 0.15: JP5.8 26.77,33.25 24.72,33.25 22.57,35.4 4.72,35.4 4.12,34.8 4.12,16.15 4.37,15.9 4.37,14.97 v4.14,14.75
USBH_D-  (via drill 0.2)
  Top 0.15: IC1.R14 8.42,15.95 8.42,15.34 7.97,14.9 4.77,14.9 4.52,15.15 3.77,15.15 v3.67,15.05
  InnerBottom 0.15: JP5.6 27.29,36.31 26.69,36.31 26.03,35.65 4.57,35.65 3.87,34.94 3.87,16.05 4.12,15.8 4.12,15.35 3.82,15.05 v3.67,15.05
USBH_ID  (via drill 0.2)
  Top 0.13: IC1.P12 9.74,17.92 8.5,17.92
  Top 0.15: v4.52,17.95 4.87,18.3 8.12,18.3 8.5,17.92
  InnerBottom 0.15: JP5.10 26.82,33 24.57,33 22.42,35.15 4.87,35.15 4.37,34.65 4.37,18.4 4.52,18.25 v4.52,17.95
USBH_VBUS  (via drill 0.2)
  Top 0.13: 9.25,17.27 9.74,17.27 IC1.P13
  Top 0.15: 9.25,17.27 8.17,16.19 8.17,15.45 7.87,15.15 4.92,15.15 4.47,15.6 v3.7,15.6 v3.69,15.6
  InnerBottom 0.15: JP5.4 26.72,38.28 26.72,36.75 25.92,35.95 4.52,35.95 3.62,35.05 3.62,15.68 v3.69,15.6

## Text on the board
bPlace: 2 1 | 96 95 | 3 | 94 | 5 | 7 | 9 | 11 | 86 | 13 | 84 | Xibeca Rev02 | 15 | 82 | 17 | 80 | PDR | 19 | 78 | BOOT | 21 | 76 | 23 | 74 | 25 | 72 | 27 | 70 | 29 | 68 | 31 | 66